# Altium schematic sheet USB.SchDoc: USB
size A3; Author: Silvio Navaretti; CompanyName: ARDUINO; DrawnBy: Silvio Navaretti; Engineer: Silvio Navaretti; Organization: ARDUINO; SheetNumber: 30; SheetTotal: 51; RevAuthor: Silvio Navaretti
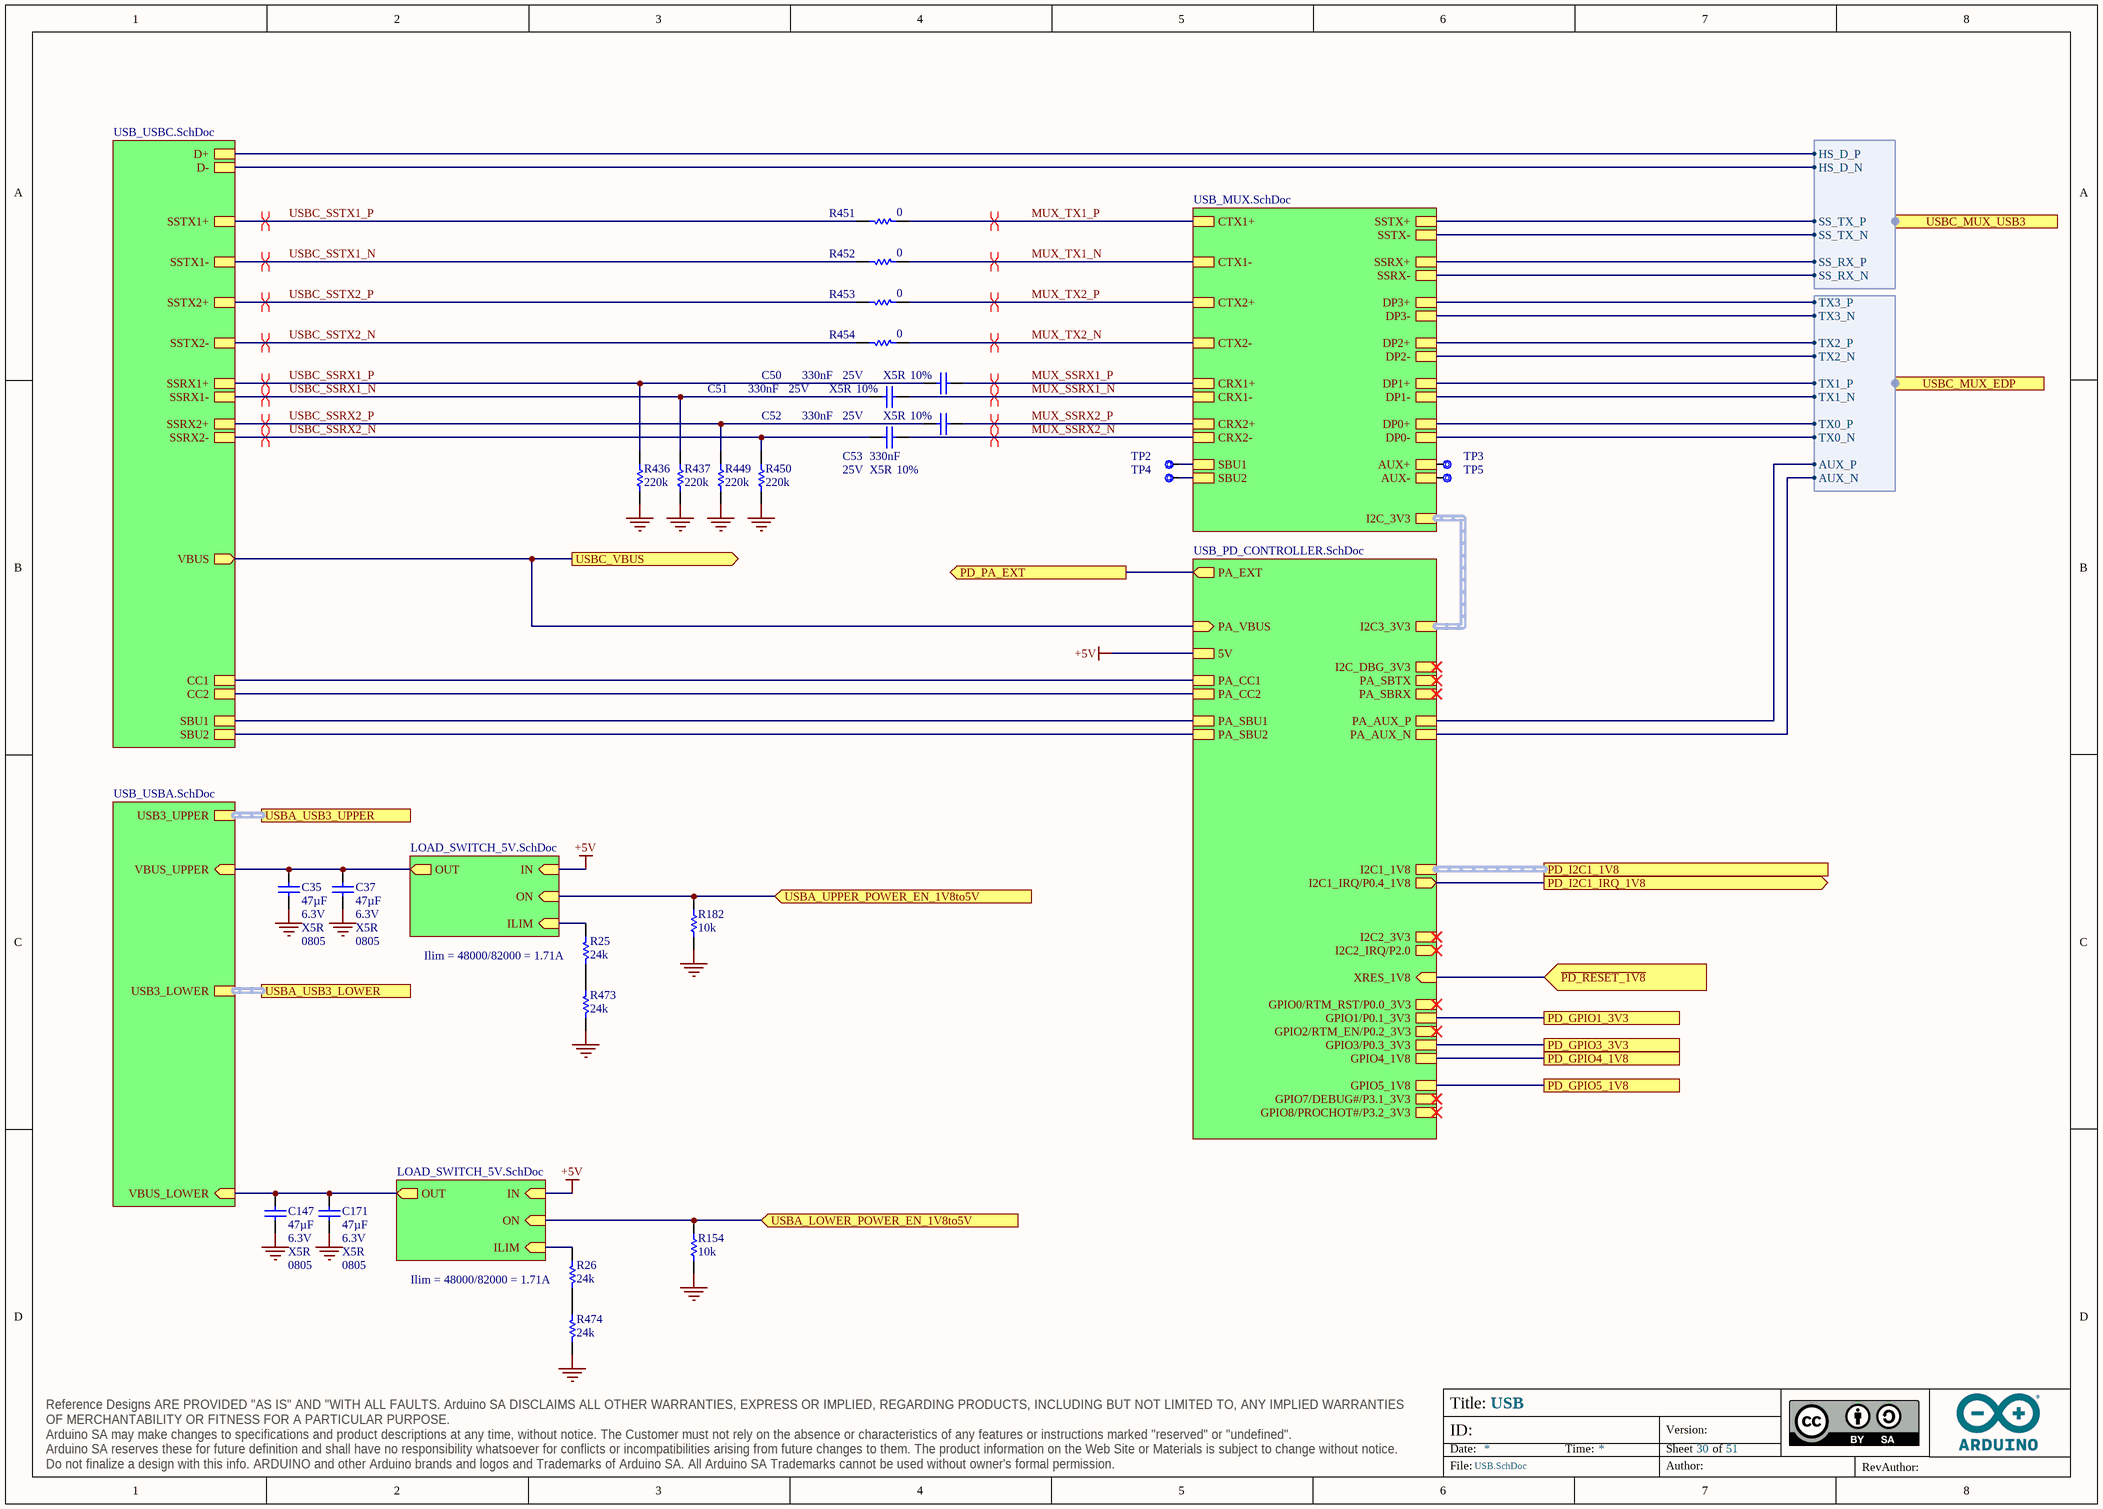
[diagram p0: USB.SchDoc]

## Parts
C35  value 47µF  Voltage: 6.3V  Dielectric: X5R  Case Code (Imperial): 0805  [CAP-0805]  (hidden comment: C0805C476M9PAC7800)
C37  value 47µF  Voltage: 6.3V  Dielectric: X5R  Case Code (Imperial): 0805  [CAP-0805]  (hidden comment: C0805C476M9PAC7800)
C50  value 330nF  Voltage: 25V  Dielectric: X5R  Tolerance: 10%  [CAP-0201]  (hidden comment: CL03A334KA3NRNC)
C51  value 330nF  Voltage: 25V  Dielectric: X5R  Tolerance: 10%  [CAP-0201]  (hidden comment: CL03A334KA3NRNC)
C52  value 330nF  Voltage: 25V  Dielectric: X5R  Tolerance: 10%  [CAP-0201]  (hidden comment: CL03A334KA3NRNC)
C53  value 330nF  Voltage: 25V  Dielectric: X5R  Tolerance: 10%  [CAP-0201]  (hidden comment: CL03A334KA3NRNC)
C147  value 47µF  Voltage: 6.3V  Dielectric: X5R  Case Code (Imperial): 0805  [CAP-0805]  (hidden comment: C0805C476M9PAC7800)
C171  value 47µF  Voltage: 6.3V  Dielectric: X5R  Case Code (Imperial): 0805  [CAP-0805]  (hidden comment: C0805C476M9PAC7800)
R25  value 24k  [RES-0201]  (hidden comment: RC0201FR-0724KL)
R26  value 24k  [RES-0201]  (hidden comment: RC0201FR-0724KL)
R154  value 10k  [RES-0201]  (hidden comment: RC0201FR-0710KL)
R182  value 10k  [RES-0201]  (hidden comment: RC0201FR-0710KL)
R436  value 220k  [RES-0201]  (hidden comment: AC0201FR-07220KL)
R437  value 220k  [RES-0201]  (hidden comment: AC0201FR-07220KL)
R449  value 220k  [RES-0201]  (hidden comment: AC0201FR-07220KL)
R450  value 220k  [RES-0201]  (hidden comment: AC0201FR-07220KL)
R451  value 0  [RES-0201]  (hidden comment: CRCW02010000Z0ED)
R452  value 0  [RES-0201]  (hidden comment: CRCW02010000Z0ED)
R453  value 0  [RES-0201]  (hidden comment: CRCW02010000Z0ED)
R454  value 0  [RES-0201]  (hidden comment: CRCW02010000Z0ED)
R473  value 24k  [RES-0201]  (hidden comment: RC0201FR-0724KL)
R474  value 24k  [RES-0201]  (hidden comment: RC0201FR-0724KL)
TP2  Test point 1.00mm  [TP-1.00MM]  (value not drawn)  (no BOM)
TP3  Test point 1.00mm  [TP-1.00MM]  (value not drawn)  (no BOM)
TP4  Test point 1.00mm  [TP-1.00MM]  (value not drawn)  (no BOM)
TP5  Test point 1.00mm  [TP-1.00MM]  (value not drawn)  (no BOM)

## Sub-sheets
U_LOAD_SWITCH_5V = LOAD_SWITCH_5V.SchDoc: IN (in), OUT (out), ON (in), ILIM (in)
U_LOAD_SWITCH_5V = LOAD_SWITCH_5V.SchDoc: IN (in), OUT (out), ON (in), ILIM (in)
U_USB_MUX = USB_MUX.SchDoc: I2C_3V3 (harness I2C), SSTX-, SSTX+, SBU1, SBU2, SSRX-, SSRX+, DP3+, DP3-, DP2+, DP2-, DP1+, DP1-, DP0+, DP0-, AUX+, AUX-, CTX2+, CTX2-, CRX2+, CRX2-, CRX1+, CRX1-, CTX1+, CTX1-
U_USB_PD_CONTROLLER = USB_PD_CONTROLLER.SchDoc: 5V, PA_VBUS (in), PA_EXT (out), PA_SBU2, PA_SBU1, PA_CC2, PA_CC1, PA_SBTX, PA_SBRX, PA_AUX_P, PA_AUX_N, I2C2_IRQ/P2.0 (out), I2C2_3V3 (harness I2C), I2C3_3V3 (harness I2C), I2C_DBG_3V3 (harness I2C), GPIO0/RTM_RST/P0.0_3V3, GPIO1/P0.1_3V3, GPIO2/RTM_EN/P0.2_3V3, GPIO3/P0.3_3V3, GPIO7/DEBUG#/P3.1_3V3, GPIO8/PROCHOT#/P3.2_3V3, GPIO4_1V8, GPIO5_1V8, I2C1_IRQ/P0.4_1V8 (out), I2C1_1V8 (harness I2C), XRES_1V8 (in)
U_USB_USBA = USB_USBA.SchDoc: VBUS_LOWER (in), USB3_LOWER (harness SOM_MD_USB0), VBUS_UPPER (in), USB3_UPPER (harness SOM_MD_USB0)
U_USB_USBC = USB_USBC.SchDoc: D-, D+, CC1, CC2, SSTX2-, SSTX2+, SSTX1-, SSTX1+, VBUS (out), SBU1, SBU2, SSRX2-, SSRX2+, SSRX1-, SSRX1+

## Ports
PD_GPIO1_3V3, PD_GPIO3_3V3, PD_GPIO4_1V8, PD_GPIO5_1V8, PD_I2C1_1V8 (harness I2C), PD_I2C1_IRQ_1V8 (out), PD_PA_EXT (out), USBA_LOWER_POWER_EN_1V8to5V (in), USBA_UPPER_POWER_EN_1V8to5V (in), USBA_USB3_LOWER (harness SOM_MD_EDP0), USBA_USB3_UPPER (harness SOM_MD_EDP0), USBC_MUX_EDP (harness SOM_MD_EDP0), USBC_MUX_USB3 (harness SOM_MD_USB0), USBC_VBUS (out), ~{PD_RESET_1V8} (in)

## Harnesses
SOM_MD_USB0: SS_TX_N, SS_TX_P, HS_D_P, HS_D_N, SS_RX_P, SS_RX_N
SOM_MD_EDP0: TX0_P, TX1_P, TX2_P, TX3_P, AUX_P, TX0_N, TX1_N, TX2_N, TX3_N, AUX_N

## Nets
+5V: sheet U_USB_PD_CONTROLLER/5V, sheet U_LOAD_SWITCH_5V/IN, sheet U_LOAD_SWITCH_5V/IN
GND: C35.1 C37.1 C147.1 C171.1 R154.1 R182.1 R436.2 R437.2 R449.2 R450.2 R473.1 R474.1
MUX_SSRX1_N: C51.1 ; sheet U_USB_MUX/CRX1-
MUX_SSRX1_P: C50.1 ; sheet U_USB_MUX/CRX1+
MUX_SSRX2_N: C53.1 ; sheet U_USB_MUX/CRX2-
MUX_SSRX2_P: C52.1 ; sheet U_USB_MUX/CRX2+
MUX_TX1_N: R452.2 ; sheet U_USB_MUX/CTX1-
MUX_TX1_P: R451.2 ; sheet U_USB_MUX/CTX1+
MUX_TX2_N: R454.2 ; sheet U_USB_MUX/CTX2-
MUX_TX2_P: R453.2 ; sheet U_USB_MUX/CTX2+
~{PD_RESET_1V8}: port ~{PD_RESET_1V8}, sheet U_USB_PD_CONTROLLER/XRES_1V8
PD_GPIO1_3V3: port PD_GPIO1_3V3, sheet U_USB_PD_CONTROLLER/GPIO1/P0.1_3V3
PD_GPIO3_3V3: port PD_GPIO3_3V3, sheet U_USB_PD_CONTROLLER/GPIO3/P0.3_3V3
PD_GPIO4_1V8: port PD_GPIO4_1V8, sheet U_USB_PD_CONTROLLER/GPIO4_1V8
PD_GPIO5_1V8: port PD_GPIO5_1V8, sheet U_USB_PD_CONTROLLER/GPIO5_1V8
PD_I2C1_IRQ_1V8: port PD_I2C1_IRQ_1V8, sheet U_USB_PD_CONTROLLER/I2C1_IRQ/P0.4_1V8
PD_PA_EXT: port PD_PA_EXT, sheet U_USB_PD_CONTROLLER/PA_EXT
USBA_LOWER_POWER_EN_1V8to5V: R154.2 ; port USBA_LOWER_POWER_EN_1V8to5V, sheet U_LOAD_SWITCH_5V/ON
USBA_UPPER_POWER_EN_1V8to5V: R182.2 ; port USBA_UPPER_POWER_EN_1V8to5V, sheet U_LOAD_SWITCH_5V/ON
USBC_SSRX1_N: C51.2 R437.1 ; sheet U_USB_USBC/SSRX1-
USBC_SSRX1_P: C50.2 R436.1 ; sheet U_USB_USBC/SSRX1+
USBC_SSRX2_N: C53.2 R450.1 ; sheet U_USB_USBC/SSRX2-
USBC_SSRX2_P: C52.2 R449.1 ; sheet U_USB_USBC/SSRX2+
USBC_SSTX1_N: R452.1 ; sheet U_USB_USBC/SSTX1-
USBC_SSTX1_P: R451.1 ; sheet U_USB_USBC/SSTX1+
USBC_SSTX2_N: R454.1 ; sheet U_USB_USBC/SSTX2-
USBC_SSTX2_P: R453.1 ; sheet U_USB_USBC/SSTX2+
USBC_VBUS: port USBC_VBUS, sheet U_USB_USBC/VBUS, sheet U_USB_PD_CONTROLLER/PA_VBUS
NetC35_2: C35.2 C37.2 ; sheet U_USB_USBA/VBUS_UPPER, sheet U_LOAD_SWITCH_5V/OUT
NetC147_2: C147.2 C171.2 ; sheet U_USB_USBA/VBUS_LOWER, sheet U_LOAD_SWITCH_5V/OUT
NetR25_1: R25.1 R473.2
NetR25_2: R25.2 ; sheet U_LOAD_SWITCH_5V/ILIM
NetR26_1: R26.1 R474.2
NetR26_2: R26.2 ; sheet U_LOAD_SWITCH_5V/ILIM
NetTP2_X: TP2.X ; sheet U_USB_MUX/SBU1
NetTP3_X: TP3.X ; sheet U_USB_MUX/AUX+
NetTP4_X: TP4.X ; sheet U_USB_MUX/SBU2
NetTP5_X: TP5.X ; sheet U_USB_MUX/AUX-
(unnamed): sheet U_USB_USBC/D-, port USBC_MUX_USB3.HS_D_N
(unnamed): sheet U_USB_USBC/D+, port USBC_MUX_USB3.HS_D_P
(unnamed): sheet U_USB_USBC/CC1, sheet U_USB_PD_CONTROLLER/PA_CC1
(unnamed): sheet U_USB_USBC/CC2, sheet U_USB_PD_CONTROLLER/PA_CC2
(unnamed): sheet U_USB_USBC/SBU1, sheet U_USB_PD_CONTROLLER/PA_SBU1
(unnamed): sheet U_USB_USBC/SBU2, sheet U_USB_PD_CONTROLLER/PA_SBU2
(unnamed): sheet U_USB_MUX/SSTX-, port USBC_MUX_USB3.SS_TX_N
(unnamed): sheet U_USB_MUX/SSTX+, port USBC_MUX_USB3.SS_TX_P
(unnamed): sheet U_USB_MUX/SSRX-, port USBC_MUX_USB3.SS_RX_N
(unnamed): sheet U_USB_MUX/SSRX+, port USBC_MUX_USB3.SS_RX_P
(unnamed): sheet U_USB_MUX/DP3+, port USBC_MUX_EDP.TX3_P
(unnamed): sheet U_USB_MUX/DP3-, port USBC_MUX_EDP.TX3_N
(unnamed): sheet U_USB_MUX/DP2+, port USBC_MUX_EDP.TX2_P
(unnamed): sheet U_USB_MUX/DP2-, port USBC_MUX_EDP.TX2_N
(unnamed): sheet U_USB_MUX/DP1+, port USBC_MUX_EDP.TX1_P
(unnamed): sheet U_USB_MUX/DP1-, port USBC_MUX_EDP.TX1_N
(unnamed): sheet U_USB_MUX/DP0+, port USBC_MUX_EDP.TX0_P
(unnamed): sheet U_USB_MUX/DP0-, port USBC_MUX_EDP.TX0_N
(unnamed): sheet U_USB_PD_CONTROLLER/PA_AUX_P, port USBC_MUX_EDP.AUX_P
(unnamed): sheet U_USB_PD_CONTROLLER/PA_AUX_N, port USBC_MUX_EDP.AUX_N

## Buses and harness runs
harness port PD_I2C1_1V8 = sheet U_USB_PD_CONTROLLER/I2C1_1V8
harness port USBA_USB3_LOWER = sheet U_USB_USBA/USB3_LOWER
harness port USBA_USB3_UPPER = sheet U_USB_USBA/USB3_UPPER
harness sheet U_USB_MUX/I2C_3V3 = sheet U_USB_PD_CONTROLLER/I2C3_3V3

## Layout directives
differential pair; differential pair class DIFF_MUX_USBC; net class NET_DIFF_USBC: MUX_SSRX1_N, MUX_SSRX1_P, MUX_SSRX2_N, MUX_SSRX2_P, MUX_TX1_N, MUX_TX1_P, MUX_TX2_N, MUX_TX2_P
differential pair; differential pair class DIFF_MUXCAPS_USBC; net class NET_DIFF_USB: USBC_SSRX1_N, USBC_SSRX1_P, USBC_SSRX2_N, USBC_SSRX2_P, USBC_SSTX1_N, USBC_SSTX1_P, USBC_SSTX2_N, USBC_SSTX2_P

## Notes on the sheet
- (near R25) Ilim = 48000/82000 = 1.71A
- (near R26) Ilim = 48000/82000 = 1.71A
- Title:
- ID:
- Date:
- Time:
- Version:
- Sheet
- of
- RevAuthor:
- Reference Designs ARE PROVIDED "AS IS" AND "WITH ALL FAULTS. Arduino SA DISCLAIMS ALL OTHER WARRANTIES, EXPRESS OR IMPLIED, REGARDING PRODUCTS, INCLUDING BUT NOT LIMITED TO, ANY IMPLIED WARRANTIES OF MERCHANTABILITY OR FITNESS FOR A PARTICULAR PURPOSE.
  Arduino SA may make changes to specifications and product descriptions at any time, without notice. The Customer must not rely on the absence or characteristics of any features or instructions marked "reserved" or "undefined".
  Arduino SA reserves these for future definition and shall have no responsibility whatsoever for conflicts or incompatibilities arising from future changes to them. The product information on the Web Site or Materials is subject to change without notice.
  Do not finalize a design with this info. ARDUINO and other Arduino brands and logos and Trademarks of Arduino SA. All Arduino SA Trademarks cannot be used without owner's formal permission.
- File:
- Author:

## Library data of the parts
C35 C37 C147 C171 = C0199-A.1: CAP CHIP 0805 47uF 20% 6.3V X5R; Manufacturer: KEMET; Code Arduino: C0199; Technology: Ceramic; Tolerance: 20%; Part Number: C0805C476M9PAC7800
C50-C53 = C0201-A.1: CAP CHIP 0201 330nF 10% 25V X5R; Manufacturer: Samsung Electro-Mechanics; Code Arduino: C0201; Part Number: CL03A334KA3NRNC; Case Code (Imperial): 0201; Technology: Ceramic
R25 R26 R473 R474 = R0398-A.1: RES CHIP 0201 24k 1% 1/20W; Manufacturer: YAGEO; Power: 50mW; Code Arduino: R0398; Temperature Coefficient: 200ppm; Technology: Thick film; Tolerance: 1%; Case Code (Imperial): 0201; Part Number: RC0201FR-0724KL
R154 R182 = R0145-A.21: RES CHIP 0201 10k 1% 1/20W; Manufacturer: Yageo; Power: 50mW; Temperature coefficient: 200ppm; Code Arduino: R0145; Manufacturer 2: Samsung Electro-Mechanics; Tolerance: 1%; Case Code (Imperial): 0201; Part Number: RC0201FR-0710KL; Technology: Thick film
R436 R437 R449 R450 = R0199-A.20: RES CHIP 0201 220k 1% 1/20W; Manufacturer: Yageo; Temperature coefficient: 200ppm; Power: 50mW; Code Arduino: R0199; Part Number: AC0201FR-07220KL; Tolerance: 1%; Case Code (Imperial): 0201; Technology: Thick film
R451-R454 = R0140-A.21: RES CHIP 0201 0R; Manufacturer: Vishay; Tolerance: 0%; Code Arduino: R0140; Temperature coefficient: 0ppm; Power: 50mW; Technology: Thick film; Case Code (Imperial): 0201; Part Number: CRCW02010000Z0ED
TP2-TP5 = UT0013-A.6: Part Number: This is not a component; Design Item ID: CMP-018-0005-A.3; Source: ut.SchLib; Manufacturer: This is not a component; Code Arduino: This is not a component; Pin Count: 1